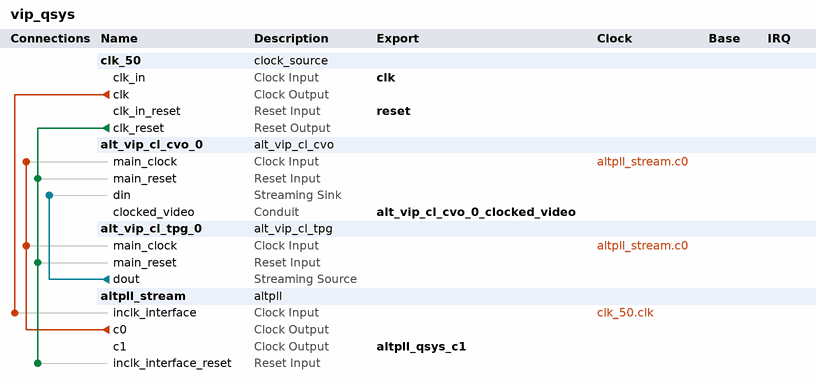
[diagram p0: system contents]
# Platform Designer (Qsys) system vip_qsys, MAX 10 10M50DAF484C6GES
# Parameters at their usual value, and those the tool derives, are not listed.
package require -exact qsys 15.0
create_system vip_qsys
set_project_property DEVICE_FAMILY {MAX 10}
set_project_property DEVICE 10M50DAF484C6GES

add_instance clk_50 clock_source 15.0
set_instance_parameter_value clk_50 clockFrequency 50000000

add_instance alt_vip_cl_cvo_0 alt_vip_cl_cvo 15.0
set_instance_parameter_value alt_vip_cl_cvo_0 ACCEPT_COLOURS_IN_SEQ 0
set_instance_parameter_value alt_vip_cl_cvo_0 ANC_LINE 0
set_instance_parameter_value alt_vip_cl_cvo_0 AP_LINE 0
set_instance_parameter_value alt_vip_cl_cvo_0 BPS 8
set_instance_parameter_value alt_vip_cl_cvo_0 CLOCKS_ARE_SAME 0
set_instance_parameter_value alt_vip_cl_cvo_0 COLOUR_PLANES_ARE_IN_PARALLEL 1
set_instance_parameter_value alt_vip_cl_cvo_0 CONTEXT_WIDTH 8
set_instance_parameter_value alt_vip_cl_cvo_0 DST_WIDTH 8
set_instance_parameter_value alt_vip_cl_cvo_0 FIELD0_ANC_LINE 0
set_instance_parameter_value alt_vip_cl_cvo_0 FIELD0_V_BACK_PORCH 0
set_instance_parameter_value alt_vip_cl_cvo_0 FIELD0_V_BLANK 0
set_instance_parameter_value alt_vip_cl_cvo_0 FIELD0_V_FRONT_PORCH 0
set_instance_parameter_value alt_vip_cl_cvo_0 FIELD0_V_RISING_EDGE 0
set_instance_parameter_value alt_vip_cl_cvo_0 FIELD0_V_SYNC_LENGTH 0
set_instance_parameter_value alt_vip_cl_cvo_0 FIFO_DEPTH 1920
set_instance_parameter_value alt_vip_cl_cvo_0 F_FALLING_EDGE 0
set_instance_parameter_value alt_vip_cl_cvo_0 F_RISING_EDGE 0
set_instance_parameter_value alt_vip_cl_cvo_0 GENERATE_SYNC 0
set_instance_parameter_value alt_vip_cl_cvo_0 H_ACTIVE_PIXELS 1920
set_instance_parameter_value alt_vip_cl_cvo_0 H_BACK_PORCH 148
set_instance_parameter_value alt_vip_cl_cvo_0 H_BLANK 0
set_instance_parameter_value alt_vip_cl_cvo_0 H_FRONT_PORCH 88
set_instance_parameter_value alt_vip_cl_cvo_0 H_SYNC_LENGTH 44
set_instance_parameter_value alt_vip_cl_cvo_0 INTERLACED 0
set_instance_parameter_value alt_vip_cl_cvo_0 NO_OF_CHANNELS 1
set_instance_parameter_value alt_vip_cl_cvo_0 NO_OF_MODES 1
set_instance_parameter_value alt_vip_cl_cvo_0 NUMBER_OF_COLOUR_PLANES 3
set_instance_parameter_value alt_vip_cl_cvo_0 PIXELS_IN_PARALLEL 1
set_instance_parameter_value alt_vip_cl_cvo_0 SRC_WIDTH 8
set_instance_parameter_value alt_vip_cl_cvo_0 STD_WIDTH 1
set_instance_parameter_value alt_vip_cl_cvo_0 TASK_WIDTH 8
set_instance_parameter_value alt_vip_cl_cvo_0 THRESHOLD 1919
set_instance_parameter_value alt_vip_cl_cvo_0 USE_CONTROL 0
set_instance_parameter_value alt_vip_cl_cvo_0 USE_EMBEDDED_SYNCS 0
set_instance_parameter_value alt_vip_cl_cvo_0 V_ACTIVE_LINES 1080
set_instance_parameter_value alt_vip_cl_cvo_0 V_BACK_PORCH 36
set_instance_parameter_value alt_vip_cl_cvo_0 V_BLANK 0
set_instance_parameter_value alt_vip_cl_cvo_0 V_FRONT_PORCH 4
set_instance_parameter_value alt_vip_cl_cvo_0 V_SYNC_LENGTH 5

add_instance alt_vip_cl_tpg_0 alt_vip_cl_tpg 15.0
set_instance_parameter_value alt_vip_cl_tpg_0 BPS 8
set_instance_parameter_value alt_vip_cl_tpg_0 COLOR_PLANES_ARE_IN_PARALLEL 1
set_instance_parameter_value alt_vip_cl_tpg_0 COLOR_SPACE RGB
set_instance_parameter_value alt_vip_cl_tpg_0 FAMILY {MAX 10}
set_instance_parameter_value alt_vip_cl_tpg_0 INTERLACING prog
set_instance_parameter_value alt_vip_cl_tpg_0 MAX_HEIGHT 1080
set_instance_parameter_value alt_vip_cl_tpg_0 MAX_WIDTH 1920
set_instance_parameter_value alt_vip_cl_tpg_0 OUTPUT_FORMAT 4.4.4
set_instance_parameter_value alt_vip_cl_tpg_0 PATTERN colorbars
set_instance_parameter_value alt_vip_cl_tpg_0 PIXELS_IN_PARALLEL 1
set_instance_parameter_value alt_vip_cl_tpg_0 RUNTIME_CONTROL 0
set_instance_parameter_value alt_vip_cl_tpg_0 UNIFORM_VALUE_BCR 16
set_instance_parameter_value alt_vip_cl_tpg_0 UNIFORM_VALUE_GCB 16
set_instance_parameter_value alt_vip_cl_tpg_0 UNIFORM_VALUE_RY 16

add_instance altpll_stream altpll 15.0
set_instance_parameter_value altpll_stream CLK0_DIVIDE_BY 100
set_instance_parameter_value altpll_stream CLK0_MULTIPLY_BY 297
set_instance_parameter_value altpll_stream CLK1_DIVIDE_BY 100
set_instance_parameter_value altpll_stream CLK1_DUTY_CYCLE 50
set_instance_parameter_value altpll_stream CLK1_MULTIPLY_BY 297
set_instance_parameter_value altpll_stream CLK1_PHASE_SHIFT 0
set_instance_parameter_value altpll_stream INCLK0_INPUT_FREQUENCY 20000
set_instance_parameter_value altpll_stream PORT_ARESET PORT_USED
set_instance_parameter_value altpll_stream PORT_LOCKED PORT_USED
set_instance_parameter_value altpll_stream PORT_clk1 PORT_USED
set_instance_parameter_value altpll_stream PORT_clk2 PORT_UNUSED
set_instance_parameter_value altpll_stream PORT_clk3 PORT_UNUSED

# connections
add_connection altpll_stream.c0 alt_vip_cl_cvo_0.main_clock clock
add_connection altpll_stream.c0 alt_vip_cl_tpg_0.main_clock clock
add_connection clk_50.clk altpll_stream.inclk_interface clock
add_connection clk_50.clk_reset alt_vip_cl_cvo_0.main_reset reset
add_connection clk_50.clk_reset alt_vip_cl_tpg_0.main_reset reset
add_connection clk_50.clk_reset altpll_stream.inclk_interface_reset reset
add_connection alt_vip_cl_tpg_0.dout alt_vip_cl_cvo_0.din avalon_streaming

# exported interfaces
add_interface alt_vip_cl_cvo_0_clocked_video conduit end
set_interface_property alt_vip_cl_cvo_0_clocked_video EXPORT_OF alt_vip_cl_cvo_0.clocked_video
add_interface altpll_qsys_c1 clock source
set_interface_property altpll_qsys_c1 EXPORT_OF altpll_stream.c1
add_interface clk clock sink
set_interface_property clk EXPORT_OF clk_50.clk_in
add_interface reset reset sink
set_interface_property reset EXPORT_OF clk_50.clk_in_reset

set_interconnect_requirement {$system} qsys_mm.clockCrossingAdapter HANDSHAKE
set_interconnect_requirement {$system} qsys_mm.enableEccProtection FALSE
set_interconnect_requirement {$system} qsys_mm.insertDefaultSlave FALSE
set_interconnect_requirement {$system} qsys_mm.maxAdditionalLatency 1

save_system vip_qsys.qsys
